# Altium schematic sheet main.SchDoc
size A3
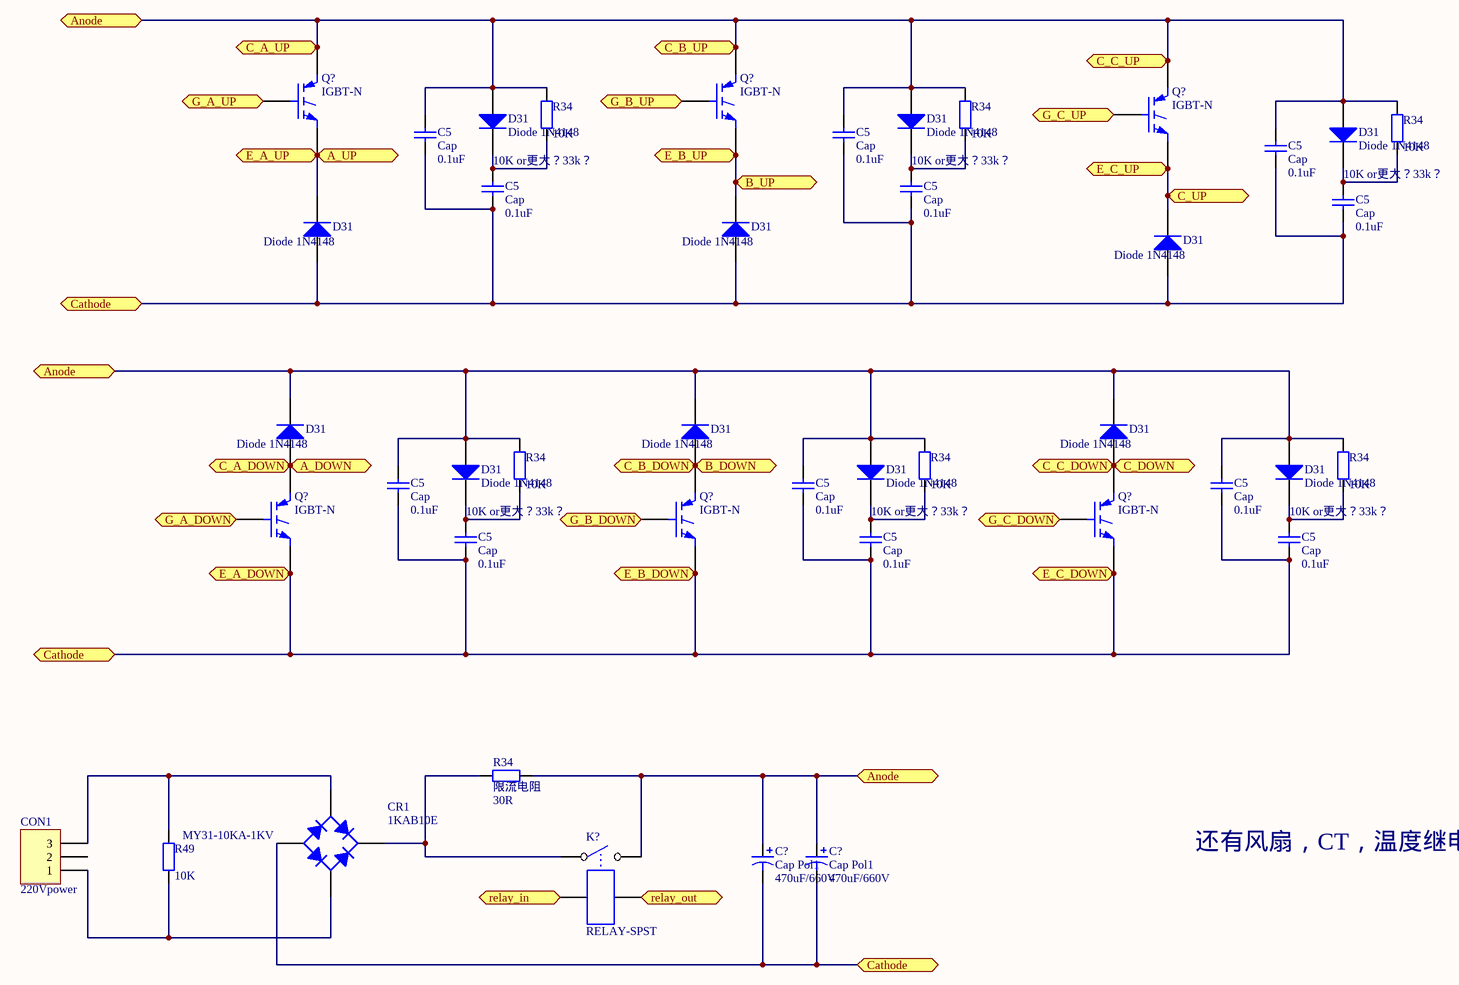
[diagram p0: main.SchDoc]

## Parts
(Parts that share a designator on the sheet are numbered #1, #2 ... from top to bottom, then left to right.)
C5#1  Cap  value 0.1uF  [1206]
C5#2  Cap  value 0.1uF  [1206]
C5#3  Cap  value 0.1uF  [1206]
C5#4  Cap  value 0.1uF  [1206]
C5#5  Cap  value 0.1uF  [1206]
C5#6  Cap  value 0.1uF  [1206]
C5#7  Cap  value 0.1uF  [1206]
C5#8  Cap  value 0.1uF  [1206]
C5#9  Cap  value 0.1uF  [1206]
C5#10  Cap  value 0.1uF  [1206]
C5#11  Cap  value 0.1uF  [1206]
C5#12  Cap  value 0.1uF  [1206]
C?#1  Cap Pol1  value 470uF/660V  [RB7.6-15]
C?#2  Cap Pol1  value 470uF/660V  [RB7.6-15]
CON1  220Vpower  [2SIP3]
CR1  1KAB10E  [D-38]
D31#1  Diode 1N4148  [SOD-80/MLL34]
D31#2  Diode 1N4148  [SOD-80/MLL34]
D31#3  Diode 1N4148  [SOD-80/MLL34]
D31#4  Diode 1N4148  [SOD-80/MLL34]
D31#5  Diode 1N4148  [SOD-80/MLL34]
D31#6  Diode 1N4148  [SOD-80/MLL34]
D31#7  Diode 1N4148  [SOD-80/MLL34]
D31#8  Diode 1N4148  [SOD-80/MLL34]
D31#9  Diode 1N4148  [SOD-80/MLL34]
D31#10  Diode 1N4148  [SOD-80/MLL34]
D31#11  Diode 1N4148  [SOD-80/MLL34]
D31#12  Diode 1N4148  [SOD-80/MLL34]
K?  RELAY-SPST
Q?#1  IGBT-N  [TO247]
Q?#2  IGBT-N  [SFM-F3/Y2.3]
Q?#3  IGBT-N  [SFM-F3/Y2.3]
Q?#4  IGBT-N  [SFM-F3/Y2.3]
Q?#5  IGBT-N  [SFM-F3/Y2.3]
Q?#6  IGBT-N  [SFM-F3/Y2.3]
R34#1  10K or更大？33k？  value 10K  [1206]
R34#2  10K or更大？33k？  value 10K  [1206]
R34#3  10K or更大？33k？  value 10K  [1206]
R34#4  10K or更大？33k？  value 10K  [1206]
R34#5  10K or更大？33k？  value 10K  [1206]
R34#6  10K or更大？33k？  value 10K  [1206]
R34#7  限流电阻  value 30R  [1206]
R49  MY31-10KA-1KV  value 10K  [AXIAL0.4]

## Ports
A_DOWN, A_UP, Anode, B_DOWN, B_UP, C_A_DOWN, C_A_UP, C_B_DOWN, C_B_UP, C_C_DOWN, C_C_UP, C_DOWN, C_UP, Cathode, E_A_DOWN, E_A_UP, E_B_DOWN, E_B_UP, E_C_DOWN, E_C_UP, G_A_DOWN, G_A_UP, G_B_DOWN, G_B_UP, G_C_DOWN, G_C_UP, relay_in, relay_out

## Nets
A_DOWN: D31#7.1(A) Q?#4.2(C) ; port C_A_DOWN, port A_DOWN
A_UP: D31#4.2(K) Q?#1.3(E) ; port E_A_UP, port A_UP
Anode: C5#1.2 C5#2.2 C5#3.2 C5#7.2 C5#8.2 C5#9.2 C?#1.1 C?#2.1 D31#1.1(A) D31#2.1(A) D31#3.1(A) D31#7.2(K) D31#8.2(K) D31#9.2(K) D31#10.1(A) D31#11.1(A) D31#12.1(A) K?.2 Q?#1.2(C) Q?#2.2(C) Q?#3.2(C) R34#1.2 R34#2.2 R34#3.2 R34#4.2 R34#5.2 R34#6.2 R34#7.1 ; port Anode, port C_A_UP, port C_B_UP, port C_C_UP
B_DOWN: D31#8.1(A) Q?#5.2(C) ; port C_B_DOWN, port B_DOWN
B_UP: D31#5.2(K) Q?#2.3(E) ; port E_B_UP, port B_UP
C_C_DOWN: D31#9.1(A) Q?#6.2(C) ; port C_C_DOWN, port C_DOWN
C_UP: D31#6.2(K) Q?#3.3(E) ; port E_C_UP, port C_UP
Cathode: C5#1.1 C5#2.1 C5#3.1 C5#4.1 C5#5.1 C5#6.1 C5#7.1 C5#8.1 C5#9.1 C5#10.1 C5#11.1 C5#12.1 C?#1.2 C?#2.2 CR1.3(A) D31#4.1(A) D31#5.1(A) D31#6.1(A) Q?#4.3(E) Q?#5.3(E) Q?#6.3(E) ; port Cathode, port E_A_DOWN, port E_B_DOWN, port E_C_DOWN
G_A_DOWN: Q?#4.1(G) ; port G_A_DOWN
G_A_UP: Q?#1.1(G) ; port G_A_UP
G_B_DOWN: Q?#5.1(G) ; port G_B_DOWN
G_B_UP: Q?#2.1(G) ; port G_B_UP
G_C_DOWN: Q?#6.1(G) ; port G_C_DOWN
G_C_UP: Q?#3.1(G) ; port G_C_UP
relay_in: K?.3 ; port relay_in
relay_out: K?.4 ; port relay_out
NetC5#4_2: C5#4.2 D31#1.2(K) R34#1.1
NetC5#5_2: C5#5.2 D31#2.2(K) R34#2.1
NetC5#6_2: C5#6.2 D31#3.2(K) R34#3.1
NetC5#10_2: C5#10.2 D31#10.2(K) R34#4.1
NetC5#11_2: C5#11.2 D31#11.2(K) R34#5.1
NetC5#12_2: C5#12.2 D31#12.2(K) R34#6.1
NetCON1_1: CON1.1 CR1.2(C) R49.1
NetCON1_3: CON1.3 CR1.4(C) R49.2
NetCR1_1: CR1.1(K) K?.1 R34#7.2

Not connected (* = marked no-connect by the designer): CON1 2

## Notes on the sheet
- 还有风扇，CT，温度继电器等

## Library data of the parts
C5#1-C5#12 = Cap: Capacitor; Published: 8-Jun-2000; LatestRevisionDate: 17-Jul-2002; LatestRevisionNote: Re-released for DXP Platform.; PackageReference: RAD-0.3; Publisher: Altium Limited
C?#1 C?#2 = Cap Pol1: Polarized Capacitor (Radial); Published: 8-Jun-2000; LatestRevisionDate: 17-Jul-2002; LatestRevisionNote: Re-released for DXP Platform.; PackageReference: RB7.6-15; Publisher: Altium Limited
CON1 = Header 3: Header, 3-Pin; LatestRevisionDate: 17-Jul-2002; LatestRevisionNote: Re-released for DXP Platform.; Publisher: Altium Limited
CR1 = 1KAB10E: 1.2 Amp Rectifier Bridge; Published: 8-Jun-2000; LatestRevisionDate: 17-Jul-2002; LatestRevisionNote: Re-released for DXP Platform.; DatasheetVersion: E2732B; PackageReference: D-38; Publisher: Altium Limited; PackageDescription: Bridge Rectifier; 4 Terminals; Body 9.4 x 9.4 mm (typ); Pitch 5.08 mm; ComponentLink1Description: Manufacturer Link; ComponentLink1URL: http://www.irf.com/; ComponentLink2Description: Datasheet; ComponentLink2URL: http://www.irf.com/product-info/datasheets/data/1kab-e.pdf
D31#1-D31#12 = Diode 1N4148: High Conductance Fast Diode; Published: 8-Jun-2000; LatestRevisionDate: 17-Jul-2002; LatestRevisionNote: Re-released for DXP Platform.; DatasheetVersion: 1997; PackageReference: DO-35; Publisher: Altium Limited; Code_JEDEC: DO-204-AH; ComponentLink1Description: Manufacturer Link; ComponentLink1URL: http://www.fairchildsemi.com/; ComponentLink2Description: Datasheet; ComponentLink2URL: http://www.fairchildsemi.com/ds/1N%2F1N4148.pdf
Q?#1-Q?#6 = IGBT-N: Insulated Gate Bipolar Transistor (N-Channel); Published: 8-Jun-2000; LatestRevisionDate: 17-Jul-2002; LatestRevisionNote: Re-released for DXP Platform.; DatasheetVersion: PD-9.684A; PackageReference: TO-247; Publisher: Altium Limited; Code_JEDEC: TO-247-AC; ComponentLink1Description: Manufacturer Link; ComponentLink1URL: http://www.irf.com/
R34#1-R34#7 R49 = Res2: Resistor; Published: 8-Jun-2000; LatestRevisionDate: 17-Jul-2002; LatestRevisionNote: Re-released for DXP Platform.; PackageReference: AXIAL-0.4; Publisher: Altium Limited